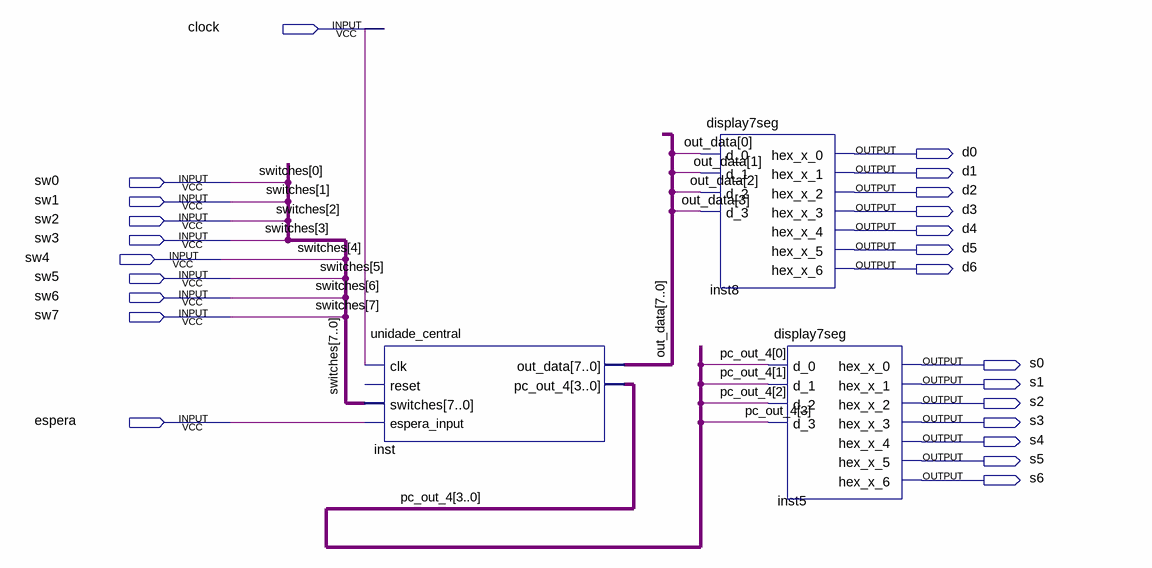
[diagram p0: schematic sheet]
// Quartus schematic debug.bdf as structural Verilog: 3 symbols, 24 pins
module debug (
  input  clock,
  input  sw0,
  input  sw1,
  input  sw2,
  input  sw3,
  input  sw4,
  input  sw5,
  input  sw6,
  input  sw7,
  input  espera,
  output d0,
  output d1,
  output d2,
  output d3,
  output d4,
  output d5,
  output d6,
  output s0,
  output s1,
  output s2,
  output s3,
  output s4,
  output s5,
  output s6
);

  wire [3:0] pc_out_4;
  wire [7:0] out_data;

  unidade_central inst (
    .clk(clock), .switches({sw7, sw6, sw5, sw4, sw3, sw2, sw1, sw0}), .espera_input(espera),
    .out_data(out_data), .pc_out_4(pc_out_4));  // open: reset
  display7seg inst8 (
    .d_0(out_data[0]), .d_1(out_data[1]), .d_2(out_data[2]), .d_3(out_data[3]), .hex_x_0(d0), .hex_x_1(d1),
    .hex_x_2(d2), .hex_x_3(d3), .hex_x_4(d4), .hex_x_5(d5), .hex_x_6(d6));
  display7seg inst5 (
    .d_0(pc_out_4[0]), .d_1(pc_out_4[1]), .d_2(pc_out_4[2]), .d_3(pc_out_4[3]), .hex_x_0(s0), .hex_x_1(s1),
    .hex_x_2(s2), .hex_x_3(s3), .hex_x_4(s4), .hex_x_5(s5), .hex_x_6(s6));

  // Other names for the same wires on the sheet: switches[7:0] = {sw7, sw6, sw5, sw4, sw3, sw2, sw1, sw0}
endmodule
